# EAGLE board Calciatore Rev.2 DOWN (EAGLE 8.5.0)
Robot Calciatore SMD V2 Costruttori: Fabio Ricci Alessio Di Brigida
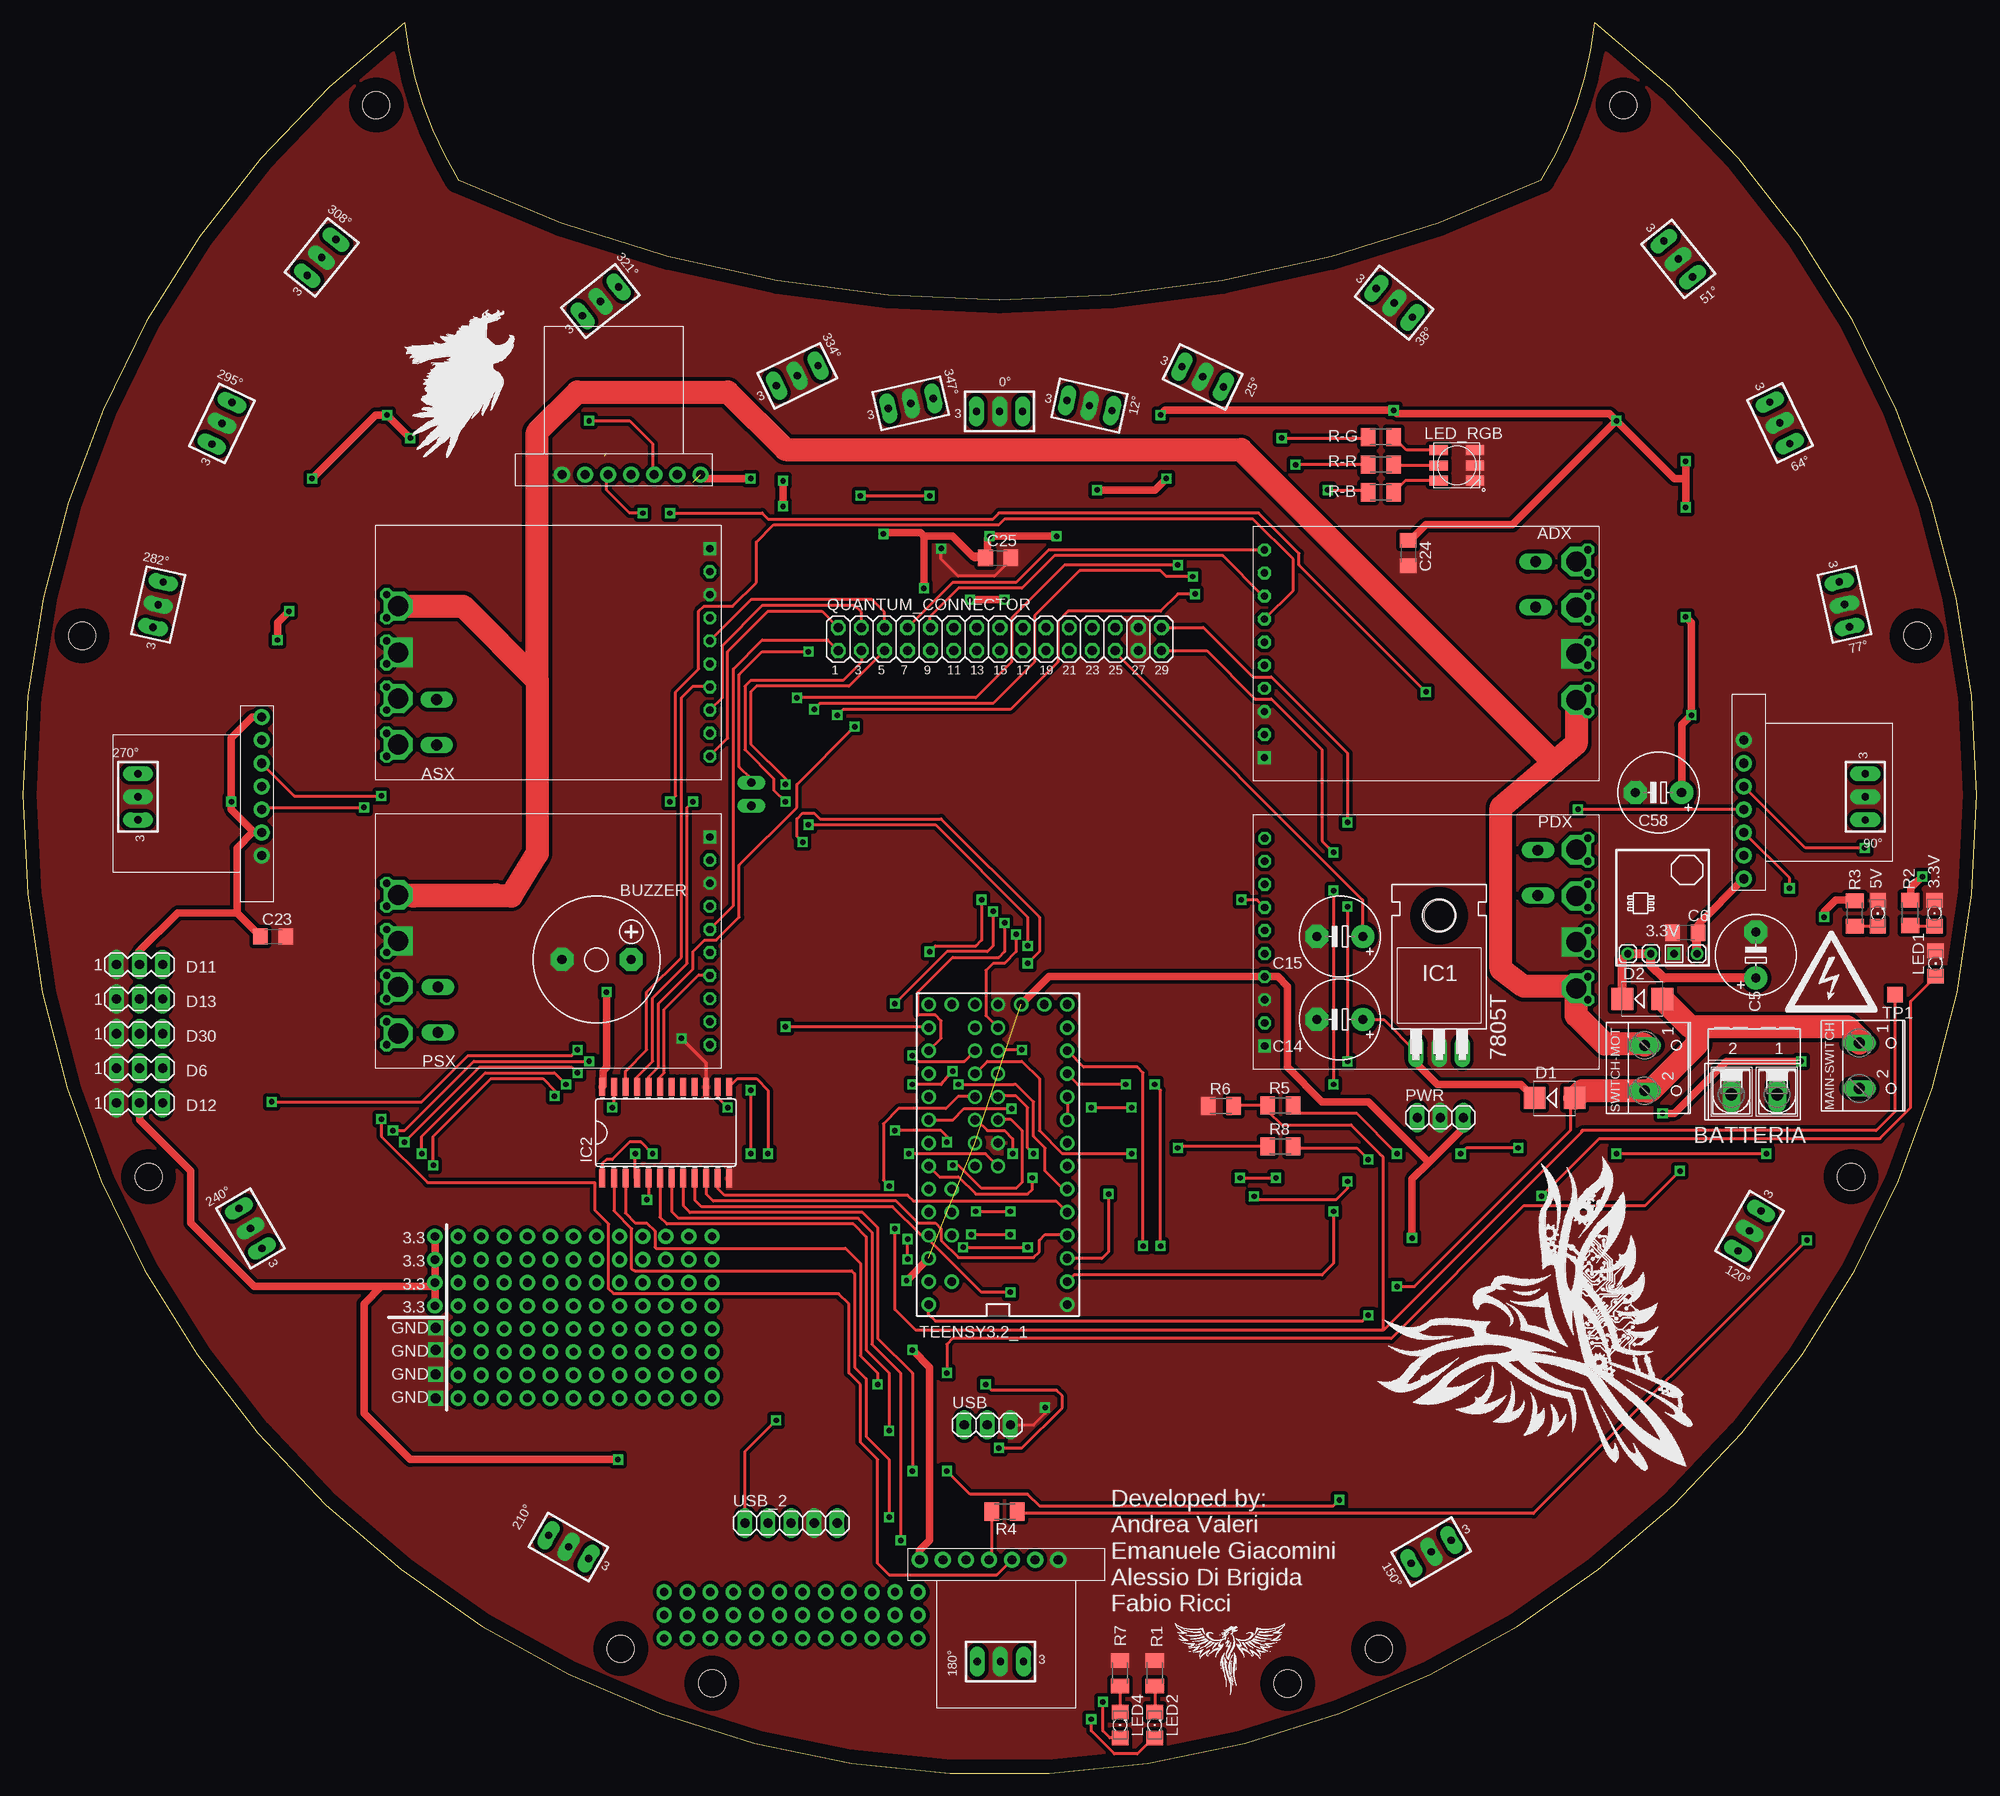
[diagram p3: board, top side]
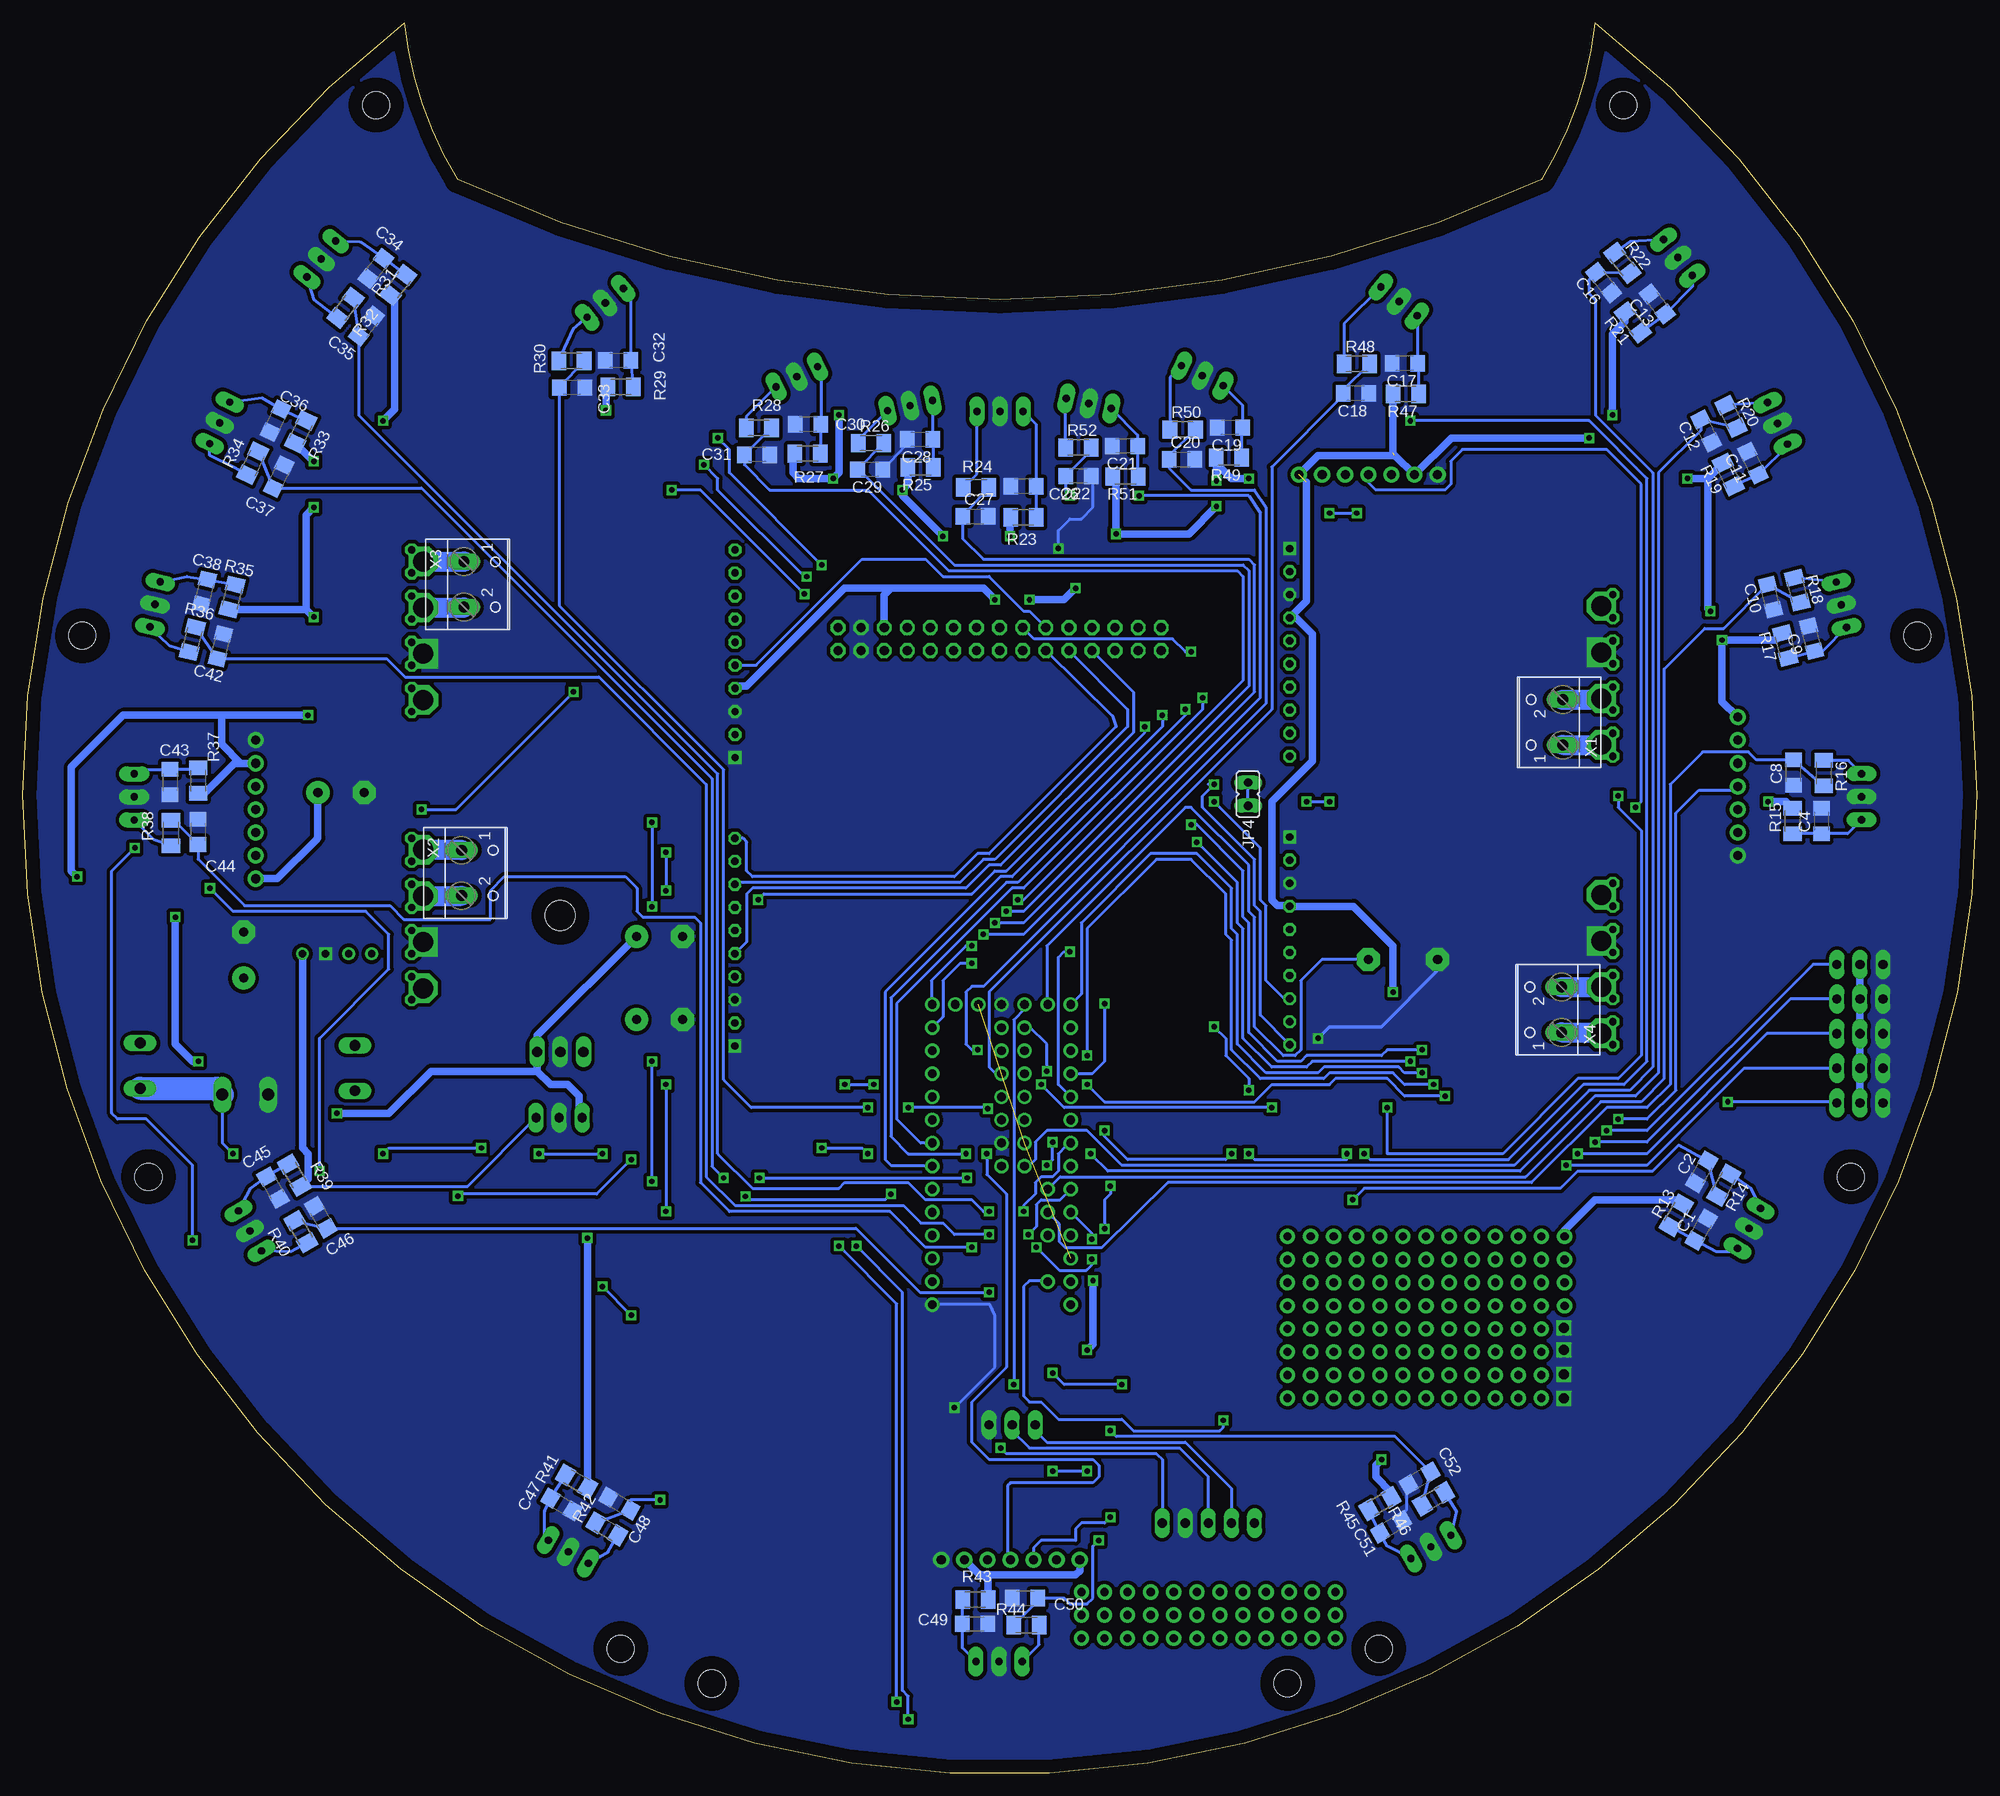
[diagram p4: board, bottom side, seen from below]

Size 214.99 x 192.6 mm. Coordinates in mm from the lower left corner, seen from the top.
Outline: 167.1,175.33 arc25 173,192.6 arc-25 167.1,175.33
Outline: 47.9,175.33 arc50 167.1,175.33
Outline: 47.9,175.33 arc-25 42,192.6 arc285 172.99,192.6
Copper layers (1*16): Top 0.035mm / dielectric 1.5mm / Bottom 0.035mm
Design rules "SparkFun *": minimum track width 8mil, minimum drill 20mil, track to track 8mil, track to pad 8mil, pad to pad 8mil, via to via 8mil, smd to smd 8mil, copper to edge 1.5mm, drill to drill 8mil, minimum pad ring 12mil, minimum via ring 10mil, stop-mask expansion 4mil, vias tented up to drill 25mil, thermal gap 0mil
Net classes: 0 default: width 0.254 mm, drill 0.254 mm, clearance 0.203 mm; 1 power: width 1.016 mm, drill 0.889 mm, clearance 0.508 mm; 2 gnd: width 0.864 mm, drill 0.406 mm, clearance 0.381 mm; 3 power usb: width 0.305 mm, drill 0.406 mm, clearance 0.203 mm
Holes 3 mm at 38.9,183.53 6.54,125.13 13.85,65.62 65.8,13.7 75.83,9.89 139.18,9.87 149.21,13.7 201.15,65.62 208.44,125.16 176.11,183.53

## Footprints (pad centres in the part's own frame; a part is rotated, then mirrored left to right if it is on the bottom)
TSOP4840 = drill 0.8 pad 1.676 long: GND 0,0; OUT -2.54,0; VCC 2.54,0
FKIT-LED-1206 = smd 1.6 x 1.803: A -1.422,0; C 1.422,0
MOTOR-SHIELD = drill 0.8 octagon: CS 29.21,-5.08; ENA/DIAGA 29.21,-10.16; ENB/DIAGB 29.21,-2.54; GND2 29.21,5.08; GNDMOT-2 -6.35,0; GNDMOT-3 -6.35,-2.54; INA 29.21,-12.7; INB 29.21,0; OUTA-2 -6.35,-10.16; OUTA-3 -6.35,-12.7; OUTB-2 -6.35,-5.08; OUTB-3 -6.35,-7.62; PWM 29.21,-7.62; VDD 29.21,2.54; VMOT-2 -6.35,5.08; VMOT-3 -6.35,2.54; VOUT 29.21,7.62 | drill 0.8 square: GND 29.21,10.16 | drill 2.2 square: GNDMOT-1 -5.08,-1.27 | drill 2.2 octagon: INMOT1 -5.08,-6.35; INMOT2 -5.08,-11.43; VMOT-1 -5.08,3.81
MB1010 = drill 1 pad 1.778: AN 2.54,-2.54; BW 7.62,-2.54; GND -7.62,-2.54; PW 5.08,-2.54; RX 0,-2.54; TX -2.54,-2.54; VCC -5.08,-2.54
AK500/2-H = drill 1.321 long: 1 -2.515,0; 2 2.515,0
F/CM12P = drill 1.016 pad 2.54 octagon: + 3.81,0; - -3.81,0
C1206 = smd 1.6 x 1.8: 1 -1.4,0; 2 1.4,0
E5-8,5 = drill 1.016 pad 2.54: + -2.54,0 | drill 1.016 pad 2.54 octagon: - 2.54,0
SMB = smd 2.4 x 2.4: A 2.2,0; C -2.2,0
MA03-1 = drill 1.016 long: 1 -2.54,0; 2 0,0; 3 2.54,0
TO220H = drill 1.118 long: 1 -2.54,-10.16; 2 0,-10.16; 3 2.54,-10.16 | hole 3.302: 0,4.826
SO24W = smd 0.66 x 2.032: 1 -6.985,-5.029; 2 -5.715,-5.029; 3 -4.445,-5.029; 4 -3.175,-5.029; 5 -1.905,-5.029; 6 -0.635,-5.029; 7 0.635,-5.029; 8 1.905,-5.029; 9 3.175,-5.029; 10 4.445,-5.029; 11 5.715,-5.029; 12 6.985,-5.029; 13 6.985,5.029; 14 5.715,5.029; 15 4.445,5.029; 16 3.175,5.029; 17 1.905,5.029; 18 0.635,5.029; 19 -0.635,5.029; 20 -1.905,5.029; 21 -3.175,5.029; 22 -4.445,5.029; 23 -5.715,5.029; 24 -6.985,5.029
JP1 = drill 0.914 long: 1 0,-1.27; 2 0,1.27
1206 = smd 1.6 x 1.803: A -1.422,0; C 1.422,0
RGBLED5050 = smd 2 x 1.1: 1 -2,1.7; 2 -2,0; 3 -2,-1.7; 4 2,-1.7; 5 2,0; 6 2,1.7
W237-102 = drill 1.194 long: 1 -2.5,-1.27; 2 2.5,-1.27
1X03 = drill 1.016 long: 1 -2.54,0; 2 0,0; 3 2.54,0
2X15 = drill 1.016 octagon: 1 -17.78,-1.27; 2 -17.78,1.27; 3 -15.24,-1.27; 4 -15.24,1.27; 5 -12.7,-1.27; 6 -12.7,1.27; 7 -10.16,-1.27; 8 -10.16,1.27; 9 -7.62,-1.27; 10 -7.62,1.27; 11 -5.08,-1.27; 12 -5.08,1.27; 13 -2.54,-1.27; 14 -2.54,1.27; 15 0,-1.27; 16 0,1.27; 17 2.54,-1.27; 18 2.54,1.27; 19 5.08,-1.27; 20 5.08,1.27; 21 7.62,-1.27; 22 7.62,1.27; 23 10.16,-1.27; 24 10.16,1.27; 25 12.7,-1.27; 26 12.7,1.27; 27 15.24,-1.27; 28 15.24,1.27; 29 17.78,-1.27; 30 17.78,1.27
M1206 = smd 1.6 x 2: 1 -1.4,0; 2 1.4,0
TEENSY3_ALL_PINS_&_PADS = drill 0.965: 0 -7.62,13.97; 1 -7.62,11.43; 2 -7.62,8.89; 3 -7.62,6.35; 3.3V 7.62,11.43; 3.3V1 -2.54,-16.51; 3.3V2 2.54,-1.27; 4 -7.62,3.81; 5 -7.62,1.27; 6 -7.62,-1.27; 7 -7.62,-3.81; 8 -7.62,-6.35; 9 -7.62,-8.89; 10 -7.62,-11.43; 11 -7.62,-13.97; 12 -7.62,-16.51; 13 7.62,-16.51; 14/A0 7.62,-13.97; 15/A1 7.62,-11.43; 16/A2 7.62,-8.89; 17/A3 7.62,-6.35; 18/A4 7.62,-3.81; 19/A5 7.62,-1.27; 20/A6 7.62,1.27; 21/A7 7.62,3.81; 22/A8 7.62,6.35; 23/A9 7.62,8.89; 24 0,-3.81; 25 0,-6.35; 26 0,-8.89; 27 0,-11.43; 28 0,-13.97; 29 2.54,-13.97; 30 2.54,-11.43; 31 2.54,-8.89; 32 2.54,-6.35; 33 2.54,-3.81; A10 5.08,6.35; A11 5.08,3.81; A12 0,1.27; A13 2.54,1.27; AGND 7.62,13.97; AREF 5.08,8.89; GND -7.62,16.51; GND1 0,-16.51; GND2 0,-1.27; PGM 2.54,-16.51; RESET/DAC 5.08,-16.51; VBAT -5.08,-16.51; VIN 7.62,16.51; VUSB 5.08,13.97
TP17SQ = smd 1.7 x 1.7: TP 0,0
QRE1113-W = smd 1.778 x 0.762: 1 -1.927,-0.9; 2 1.927,-0.9; 3 1.927,0.9; 4 -1.927,0.9
ALIM_SWITCHING = drill 0.8 square: GND 1.27,-3.81 | drill 0.8: SHDN -3.81,-3.81; VIN -1.27,-3.81; VOUT 3.81,-3.81
1X05 = drill 1.016 long: 1 -5.08,0; 2 -2.54,0; 3 0,0; 4 2.54,0; 5 5.08,0

## Placement (x,y rotation side)
0°  effe  [TSOP4840]  107.47,149.84 180 top
3.3V  Power LED  [FKIT-LED-1206]  210.34,94.61 90 top
5V  Power LED  [FKIT-LED-1206]  204.11,94.61 90 top
12°  effe  [TSOP4840]  117.38,150.48 167.2 top
25°  effe  [TSOP4840]  129.82,153.65 154.2 top
38°  effe  [TSOP4840]  150.91,161.78 141.4 top
51°  effe  [TSOP4840]  182.15,166.6 128.6 top
64°  effe  [TSOP4840]  193.32,148.57 115.8 top
77°  effe  [TSOP4840]  200.44,128.6 102.8 top
90°  effe  [TSOP4840]  202.72,107.42 90 top
120°  effe  [TSOP4840]  190,59.67 60 top
150°  effe  [TSOP4840]  154.97,24.36 30 top
180°  effe  [TSOP4840]  107.57,12.27 0 top
210°  effe  [TSOP4840]  60.05,24.9 330 top
240°  effe  [TSOP4840]  25.06,59.94 300 top
270°  effe  [TSOP4840]  12.67,107.44 270 top
282°  effe  [TSOP4840]  14.9,128.57 257.2 top
295°  effe  [TSOP4840]  21.91,148.53 244.2 top
308°  effe  [TSOP4840]  32.88,166.77 231.4 top
321°  effe  [TSOP4840]  63.57,161.94 218.6 top
334°  effe  [TSOP4840]  85.21,153.76 205.8 top
347°  effe  [TSOP4840]  97.71,150.72 192.8 top
ADX  VHN5019  [MOTOR-SHIELD]  165.84,121.9 180 top
ASX  VHN5019  [MOTOR-SHIELD]  46.38,124.59 0 top
AX  MB1010  [MB1010]  66.95,145.41 0 top
BATTERIA  [AK500/2-H]  190.52,74.67 180 top
BUZZER  F/CM12P  [F/CM12P]  63.14,89.53 0 top
C1  [C1206]  30.32,59.81 60 bottom
C2  [C1206]  30.27,66.16 60 bottom
C4  [C1206]  17.06,104.77 90 bottom
C5  [E5-8,5]  190.69,90.02 90 top
C6  100n  [C1206]  182.94,92.46 180 top
C8  [C1206]  20.16,110.1 90 bottom
C9  [C1206]  18.18,124.83 104 bottom
C10  [C1206]  22.7,129.41 104 bottom
C11  [C1206]  24.63,144.14 116 bottom
C12  [C1206]  29.76,147.69 116 bottom
C13  [C1206]  35.15,161.66 128 bottom
C14  [E5-8,5]  144.92,82.92 180 top
C15  220uF  [E5-8,5]  144.92,92.07 180 top
C16  [C1206]  41.04,164 128 bottom
C17  [C1206]  62.93,155.11 180 bottom
C18  [C1206]  68.32,151.81 180 bottom
C19  470n  [C1206]  82.19,148.05 180 bottom
C20  470n  [C1206]  87.47,144.54 0 bottom
C21  [C1206]  93.72,146.02 180 bottom
C22  [C1206]  98.85,142.72 180 bottom
C23  100n  [C1206]  27.58,92.07 0 top
C24  100n  [C1206]  152.42,134.23 270 top
C25  100n  [C1206]  107.33,133.72 0 top
C26  470n  [C1206]  104.91,141.58 180 bottom
C27  470n  [C1206]  110.18,138.28 0 bottom
C28  [C1206]  116.28,146.74 180 bottom
C29  [C1206]  121.75,143.42 180 bottom
C30  [C1206]  128.57,148.42 180 bottom
C31  [C1206]  134.19,145.07 180 bottom
C32  [C1206]  149.48,155.43 180 bottom
C33  [C1206]  154.56,152.44 180 bottom
C34  [C1206]  176.13,165.58 232 bottom
C35  [C1206]  177.16,159.25 232 bottom
C36  [C1206]  187.16,148.82 244 bottom
C37  [C1206]  186.83,142.66 244 bottom
C38  [C1206]  195.02,129.99 256 bottom
C42  [C1206]  193.25,123.99 256 bottom
C43  [C1206]  198.8,109.04 270 bottom
C44  [C1206]  195.71,103.58 270 bottom
C45  [C1206]  187.46,64.43 300 bottom
C46  [C1206]  182.2,61.16 300 bottom
C47  [C1206]  155.71,29.57 330 bottom
C48  [C1206]  149.34,29.67 330 bottom
C49  [C1206]  110.22,16.43 0 bottom
C50  [C1206]  104.72,19.28 0 bottom
C51  [C1206]  64.44,27.12 30 bottom
C52  [C1206]  61.31,32.44 30 bottom
C58  220uF  [E5-8,5]  179.98,107.89 180 top
D1  M7  [SMB]  168.55,74.29 0 top
D2  M7  [SMB]  178.21,85.2 0 top
D6  [MA03-1]  12.86,77.56 0 top
D11  [MA03-1]  12.85,88.98 0 top
D12  [MA03-1]  12.86,73.75 0 top
D13  [MA03-1]  12.86,85.18 0 top
D30  [MA03-1]  12.86,81.37 0 top
DX  MB1010  [MB1010]  191.91,106.04 270 top
HIGHVOLTAGE  LOGO  [LOGOHV]  198.52,87.24 0 top
IC1  7805T  [TO220H]  155.85,89.53 0 top
IC2  4067D  [SO24W]  70.76,70.48 0 top
JP4  [JP1]  80.17,107.72 180 bottom
LED1  [1206]  210.47,89.09 90 top
LED2  [1206]  124.55,5.3 90 top
LED4  [1206]  120.74,5.3 90 top
LED_RGB  RGBLED5050  [RGBLED5050]  157.79,143.9 0 top
MAIN-SWITCH  [W237-102]  203.34,77.84 270 top
PDX  VHN5019  [MOTOR-SHIELD]  165.85,90.18 180 top
PSX  VHN5019  [MOTOR-SHIELD]  46.4,92.84 0 top
PWR  [1X03]  155.97,72.13 0 top
PX  MB1010  [MB1010]  106.32,20.95 180 top
QUANTUM_CONNECTOR  [2X15]  107.51,124.78 0 top
R1  330  [M1206]  124.55,11.01 270 top
R2  1K  [M1206]  207.66,94.67 90 top
R3  1K  [M1206]  201.57,94.61 90 top
R4  [M1206]  108.04,28.79 180 top
R5  10k  [M1206]  138.37,73.48 0 top
R6  3.3k  [M1206]  131.84,73.4 0 top
R7  330  [M1206]  120.74,11.01 270 top
R8  330  [M1206]  138.38,68.96 0 top
R13  [M1206]  33.06,61.39 60 bottom
R14  [M1206]  27.84,64.7 240 bottom
R15  [M1206]  20.26,104.77 90 bottom
R16  [M1206]  16.82,110.04 270 bottom
R17  [M1206]  21.07,124.07 104 bottom
R18  [M1206]  19.75,130.17 284 bottom
R19  [M1206]  27.32,142.87 116 bottom
R20  [M1206]  27.03,149.28 296 bottom
R21  [M1206]  37.84,159.63 128 bottom
R22  [M1206]  38.99,166.18 308 bottom
R23  1K  [M1206]  104.91,138.18 180 bottom
R24  33K  [M1206]  110.09,141.48 0 bottom
R25  [M1206]  116.22,143.67 180 bottom
R26  [M1206]  121.67,146.34 0 bottom
R27  [M1206]  128.63,145.2 180 bottom
R28  [M1206]  134,148.03 0 bottom
R29  [M1206]  149.19,152.54 180 bottom
R30  [M1206]  154.63,155.39 0 bottom
R31  [M1206]  173.68,163.74 232 bottom
R32  [M1206]  179.48,161.21 52 bottom
R33  [M1206]  184.4,147.59 244 bottom
R34  [M1206]  189.68,144.13 64 bottom
R35  [M1206]  191.96,129.41 256 bottom
R36  [M1206]  196.33,124.72 76 bottom
R37  [M1206]  195.67,109.2 270 bottom
R38  [M1206]  198.68,103.45 90 bottom
R39  [M1206]  185.09,65.8 300 bottom
R40  [M1206]  184.38,59.58 120 bottom
R41  [M1206]  154.06,32.11 330 bottom
R42  [M1206]  150.74,26.87 150 bottom
R43  [M1206]  110.18,19.11 0 bottom
R44  [M1206]  104.57,16.3 180 bottom
R45  [M1206]  65.66,29.66 30 bottom
R46  [M1206]  59.78,30.19 210 bottom
R47  [M1206]  62.83,151.76 180 bottom
R48  [M1206]  68.22,155.06 0 bottom
R49  1K  [M1206]  82.29,144.75 180 bottom
R50  33K  [M1206]  87.37,147.85 0 bottom
R51  [M1206]  93.67,142.67 180 bottom
R52  [M1206]  98.85,145.87 0 bottom
R-B  100  [M1206]  149.43,140.93 0 top
R-G  100  [M1206]  149.43,147.02 0 top
R-R  180  [M1206]  149.43,143.97 0 top
SWITCH-MOT  [W237-102]  179.72,77.59 270 top
SX  MB1010  [MB1010]  23.77,108.58 90 top
TEENSY3.2_1  TEENSY_3.1_ALL_PINS_AND_PADS  [TEENSY3_ALL_PINS_&_PADS]  107.31,68.07 180 top
TP1  PTR1TP17SQ  [TP17SQ]  205.99,85.65 90 top
U1  QRE1113SMD-W  [QRE1113-W]  -22.49,-23.38 0 top  (outside the outline)
U$5  [EAGLE-PLC-12MM]  54.05,161.02 180 top
U$8  PHOENIX_LOGHI  [PHOENIX_LOGHI]  126.48,8.4 0 top
U$10  ALIM  [ALIM_SWITCHING]  180.41,93.97 0 top
U$12  [PHOENIX]  168.93,48.38 45 top
USB  [1X03]  106.13,38.32 0 top
USB_2  [1X05]  84.54,27.52 0 top
X1  [W237-102]  46.82,115.63 90 bottom
X2  [W237-102]  165.45,99.06 270 bottom
X3  [W237-102]  165.18,130.8 270 bottom
X4  [W237-102]  46.96,84.01 90 bottom

## Tracks (layer width: path | path; a pad name or v marks a point on that pad's centre or on a via)
3.3V  (via drill 0.6, 0.9 pad 1.68)  (4 unrouted)
  Top 0.305: 25.76,91.66 C23.1 | 207.73,96.14 R2.2 | C24.1 152.65,135.63 | 94.83,136.49 v94.7,136.36
  Top 0.813: C6.1 184.33,93.38 DX.BW | 207.73,96.14 207.73,97.37 v209,98.64 | v182.97,127.22 183.6,126.58 v183.6,116.42 182.53,115.35 182.53,107.91 C58.+ | v182.97,139.28 182.97,142.46 | 182.97,142.46 v182.97,144.36 | 182.97,142.46 181.7,142.46 v175.35,148.81 | v175.35,148.81 174.58,149.57 151.22,149.57 v150.84,149.95 125.69,149.95 v125.18,149.44 | 152.65,135.63 154.39,137.38 163.92,137.38 v175.35,148.81 | v125.82,142.46 124.55,141.19 v118.2,141.19 | v113.75,136.11 v106.39,136.11 106.13,135.85 106.13,133.92 | 106.13,133.92 104.5,133.92 | 104.5,133.92 102.32,136.11 99.15,136.11 | 94.83,136.49 98.77,136.49 99.15,136.11 | 104.5,133.92 104.7,133.72 C25.1 106.13,133.92 | 99.15,136.11 v99.15,130.39 | v104.23,129.12 v108.04,129.12 | v83.65,139.41 v83.65,142.2 | v80.1,142.46 74.98,142.46 AX.BW | v42.63,146.9 v40.09,149.44 38.82,149.44 v31.84,142.46 | v29.3,127.85 28.03,126.58 v28.03,124.68 | SX.BW 25.26,116.2 22.95,113.88 v22.95,106.9 22.95,106.04 25.49,103.5 | SX.VCC 25.49,103.5 | 25.49,103.5 25.26,103.5 23.58,101.82 23.58,94.66 | 23.58,94.66 C23.1 | 23.58,94.66 17.06,94.66 12.79,90.39 12.79,89.04 D11.2 | D12.2 12.86,71.9 18.5,66.26 18.5,60.54 25.49,53.56 39.46,53.56 | 39.46,53.56 44.94,53.56 v45.36,53.97 | v45.36,51.43 v45.36,53.97 | v45.36,53.97 v45.36,56.51 v45.36,59.05 | v65.49,34.51 42.63,34.51 37.55,39.59 37.55,51.65 39.46,53.56 | 154.71,67.21 148.04,73.88 142.96,73.88 139.15,77.69 139.15,86.58 138.09,87.64 PDX.VDD 112.91,87.64 TEENSY3.2_1.3.3V1 | PWR.3 158.51,71.01 154.71,67.21 | 154.71,67.21 152.87,65.37 v152.87,58.89 | PX.BW 98.7,24.53 99.78,25.62 99.78,44.67 v97.88,46.57 | v97.24,54.19 TEENSY3.2_1.3.3V
  Top 0.813: v64.22,85.94 64.22,77.64 63.87,77.28 63.87,75.6 IC2.24
  Top 1: U$10.VOUT 184.22,92.34 C6.1
  Bottom 0.305: R39.2 166.06,64.59 PWR.3 | ASX.VDD 75.1,127.13 | 196.44,107.8 R37.2 195.03,107.8 | 152.84,58.61 v152.87,58.89 | 28.03,143.73 28.03,144.04 R19.2 | 184.24,146.27 184.95,146.27 R33.2 | 83.27,144.33 R49.2 | 106.18,137.42 R23.2 106.13,138.01 | 117.56,143.38 R25.2
  Bottom 0.813: U$10.VOUT 184.22,68.78 183.6,68.16 183.6,65.38 R39.2 | DX.BW 187,98.42 182.66,102.76 182.66,102.78 182.53,102.91 182.53,107.87 C58.+ | 195.03,107.8 191.71,111.12 DX.VCC 191,111.12 193.13,113.25 193.13,116.42 | v209,98.64 209.64,99.28 209.64,110.71 203.92,116.42 193.13,116.42 | v183.6,116.42 193.13,116.42 | R35.2 183.8,128.05 | 183.8,128.05 v182.97,127.22 | 183.8,128.05 183.8,138.45 v182.97,139.28 | v182.97,144.36 183.05,144.36 R33.2 | v175.35,148.81 174.08,150.08 174.08,162.17 R31.2 | v150.84,149.95 150.84,152.29 R29.2 | v125.18,149.44 125.18,143.09 v125.82,142.46 129.63,142.46 130.26,143.09 130.26,144.97 R27.2 | R25.2 117.56,143.61 117.56,141.82 v118.2,141.19 118.2,140.55 v113.75,136.11 | v106.39,136.11 106.39,137.22 106.18,137.42 | R51.2 94.7,142.3 v94.7,136.36 86.7,136.36 v83.65,139.41 | v99.15,130.39 100.42,129.12 v104.23,129.12 | v108.04,129.12 109.31,130.39 119.47,130.39 | 119.47,130.39 124.55,130.39 135.34,119.6 136.39,119.6 ADX.VDD | QUANTUM_CONNECTOR.26 120.21,129.65 119.47,130.39 | v83.65,142.2 83.65,143.73 | 83.65,143.73 83.65,143.95 83.27,144.33 | v80.1,142.46 82,142.46 83.27,143.73 83.65,143.73 | AX.BW 74.57,142.91 72.48,145 63.99,145 AX.VCC 57.83,146.9 v42.63,146.9 | 64.23,145.23 R47.2 | R21.2 38.7,159.72 40.09,158.33 v40.09,149.44 | v31.84,142.46 29.61,142.46 | 29.61,142.46 R19.2 | 29.61,142.46 29.61,128.16 v29.3,127.85 | R17.2 22.17,124.68 v28.03,124.68 28.03,117.92 SX.BW | v22.95,106.9 20.99,106.9 R15.2 | D11.2 D13.2 D30.2 D6.2 D12.2 | v45.36,59.05 45.36,59.72 42,63.08 32.85,63.08 R13.2 | R45.2 64.45,30.92 66.13,32.6 66.13,33.87 v65.49,34.51 | 152.84,58.61 R41.2
  Bottom 0.813: v97.88,46.57 97.24,47.21 v97.24,54.19 | PX.BW 98.7,22.26 99.15,21.81 109.31,21.81 | 109.31,21.81 109.71,21.81 PX.VCC | R43.2 108.78,21.28 109.31,21.81 | 73.75,142.05 73.75,128.98 ASX.VDD | 75.1,127.13 74.93,127.13 73.11,125.31 73.11,111.34 77.56,106.9 77.56,96.1 76.92,95.47 75.69,95.47 PSX.VDD 68.58,95.38 64.22,91.02 v64.22,85.94
5V  (via drill 0.6)
  Top 0.305: QUANTUM_CONNECTOR.25 120.21,123.3 147.41,96.1 147.41,92.13 C15.+
  Top 0.813: v180.43,72.61 181.7,72.61 187.41,78.32 v195.67,78.32 | v198.21,94.2 198.21,94.83 199.48,96.1 201.47,96.1 R3.2
  Bottom 0.813: 158.39,77.24 IC1.3 158.39,81.15 C15.+ | 158.39,77.24 156.93,75.78 155.03,75.78 153.76,74.51 153.76,72.46 PWR.1 | 158.39,77.24 170.08,77.24 174.71,72.61 v180.43,72.61 | v195.67,78.32 196.3,78.32 198.21,80.23 v198.21,94.2
BATLVL  (via drill 0.6)
  Top 0.305: TP1.TP 205.99,72.77 203.92,70.7 171.54,70.7 171.54,70.57 149.69,48.73 | 149.69,48.73 98.26,48.73 95.97,51.02 v95.97,59.91 | TEENSY3.2_1.32 104.67,74.51 102.96,74.51 101.56,73.11 96.35,73.11 94.7,71.46 94.7,65.24 v95.34,64.61 | R6.2 133.32,73.48 R5.1 136.97,72.89 138.52,71.34 146.14,71.34 149.31,68.16 149.69,67.78 149.69,48.73
  Bottom 0.305: v95.34,64.61 95.34,63.72 95.97,63.08 v95.97,59.91
BLUE(RGB)  (via drill 0.6)
  Top 0.305: v128.99,129.76 127.09,129.76 125.18,127.85 115.02,127.85 113.88,126.71 113.88,122.26 108.67,117.06 90.26,117.06 v89.62,116.42 | v143.6,141.19 147.77,141.19 R-B.1
  Bottom 0.305: v128.99,129.76 140.42,141.19 v143.6,141.19 | v89.62,116.42 89.62,115.15 106.13,98.64 107.4,98.64 120.1,85.94 120.1,67.53 119.47,66.89 115.02,66.89 TEENSY3.2_1.5
BUZZER
  Bottom 0.305: TEENSY3.2_1.RESET/DAC 102.32,84.67 102.32,91.02 87.08,106.26 86.45,106.26 80.1,99.91 80.1,94.83 79.46,94.2 79.46,82.13 76.29,78.96 75.02,78.96 74.38,79.59 74.38,87.21 72.07,89.53 BUZZER.+
CS1
  Top 0.305: IC2.22 66.31,77.24 68.67,79.59 68.67,85.94 72.48,89.75 72.48,118.33 73.75,119.6 75.51,119.6 ASX.CS
CS2  (via drill 0.6)
  Top 0.305: IC2.21 67.58,76.6 69.3,78.32 69.3,85.31 73.11,89.12 73.11,106.26 v73.75,106.9 | v71.21,106.9 71.84,107.53 71.84,118.96 74.38,121.5 74.38,127.85 74.94,128.41 78.12,128.41 80.73,131.03 80.73,135.47 82.64,137.38 107.4,137.38 108.04,138.01 135.34,138.01 139.79,133.57 139.79,130.14 ADX.CS
  Bottom 0.305: v73.75,106.9 v71.21,106.9
CS3  (via drill 0.6)
  Top 0.305: IC2.20 68.85,76.6 69.94,77.69 69.94,84.67 73.75,88.48 73.75,90.39 75.02,91.66 76.29,91.66 78.83,94.2 78.83,99.91 85.18,106.26 85.18,108.8 v91.53,115.15 | PDX.CS 135.8,96.1 v134.07,96.1
  Bottom 0.305: v134.07,96.1 133.44,96.74 110.58,96.74 108.04,99.28 106.77,99.28 91.53,114.52 v91.53,115.15
CS4
  Top 0.305: IC2.19 70.12,76.6 70.57,77.05 70.57,84.04 74.38,87.85 75.52,87.85 PSX.CS
D+
  Bottom 0.305: USB_2.3 84.54,32.6 87.72,35.78 104.23,35.78 106.13,37.68 USB.2
D-
  Bottom 0.305: USB.1 103.59,37.68 102.32,36.41 87.08,36.41 82,31.33 USB_2.2
EXP-READ-1  (via drill 0.6)
  Top 0.305: TEENSY3.2_1.14/A0 99.59,82.13 v83.91,82.13 | v80.1,75.15 v80.1,68.16 | v69.3,68.16 68.03,69.43 66.76,69.43 64.86,67.53 64.22,67.53 63.77,67.08 IC2.1
  Bottom 0.305: v83.91,82.13 82.64,80.86 82.64,78.96 80.1,76.42 v80.1,75.15 | v80.1,68.16 79.46,67.53 69.3,67.53 v69.3,68.16
EXPA
  Top 0.305: IC2.10 75.2,63.72 75.96,62.95 96.1,62.95 98.51,60.54 100.42,60.54 101.05,59.91 101.05,58.64 102.96,56.73 111.21,56.73 111.85,57.37 111.85,58.64 112.48,59.27 114.83,59.27 TEENSY3.2_1.2
EXPB
  Top 0.305: IC2.11 76.47,64.35 77.23,63.59 97.37,63.59 98,62.95 113.69,62.95 TEENSY3.2_1.3
EXPC  (via drill 0.6)
  Top 0.305: IC2.14 76.47,74.33 v77.56,73.24 | v102.96,75.78 108.67,75.78 109.05,75.78 109.31,75.78 111.21,73.88 111.21,70.07 112.48,68.8 112.48,66.26 114.48,64.25 TEENSY3.2_1.4
  Bottom 0.305: v77.56,73.24 100.42,73.24 v102.96,75.78
EXPD  (via drill 0.6)
  Top 0.305: TEENSY3.2_1.24 107.4,71.97 108.67,71.97 109.94,70.7 109.94,64.99 109.31,64.35 105.5,64.35 102.96,66.89 v102.32,66.89 | IC2.13 78.65,76.42 80.73,76.42 82,75.15 v82,68.16 | v101.69,69.43 101.69,70.07 101.05,70.7 v95.97,70.7
  Bottom 0.305: v102.32,66.89 101.69,67.53 v101.69,69.43 | v82,68.16 82.64,67.53 93.43,67.53 95.97,70.07 v95.97,70.7
GND  (via drill 0.6, 1.1)
  Top 0.305: v112.48,40.22 112.48,39.59 111.21,38.32 USB.3 | C25.2 108.73,132.99 108.17,132.99 106.89,131.71 102.91,131.71 101.05,133.57 v101.05,134.76
  Top 0.406: v72.48,80.86 75.19,78.14 IC2.15
  Bottom 0.305: C51.2 63.22,28.49 62.72,28.99 62.72,31.53 C52.1 | TEENSY3.2_1.GND 108.57,51.55 108.04,50.38 108.04,44.67 v112.48,40.22 | v101.05,134.76 101.05,136.74 99.78,138.01 98.51,138.01 97.24,139.28 97.24,142.51 C22.1 | C29.1 117.87,146.06 C28.2
  Bottom 0.406: BUZZER.- 59.33,88.3 65.49,82.13 71.21,82.13 v72.48,80.86
  other vias: 45.43,48.98 45.43,46.57 45.43,43.9 45.43,41.24
  pour Top (isolate 0.406): -25.31,195.8 245.83,192.62 245.83,-21.37 -25.31,-18.2
  pour Bottom (isolate 0.406): -19.6,197.07 258.53,195.8 258.53,-19.47 -19.6,-18.2
GREEN(RGB)  (via drill 0.6)
  Top 0.305: v127.09,132.93 114.64,132.93 108.8,127.09 108.8,122.26 104.86,118.33 v85.18,118.33 | v138.52,146.9 147.91,146.9 R-G.1
  Bottom 0.305: v127.09,132.93 137.25,143.09 137.25,145.63 v138.52,146.9 | v85.18,118.33 85.18,117.06 104.86,97.37 106.13,97.37 118.83,84.67 118.83,71.97 116.19,69.33 TEENSY3.2_1.6
INA1-31-2
  Top 0.305: ASX.INA 75.59,111.92 77.56,113.88 77.56,123.41 82,127.85 87.93,127.85 QUANTUM_CONNECTOR.2
INA2-32-2
  Top 0.305: ADX.INA 112.88,134.6 109.31,131.03 102.32,131.03 QUANTUM_CONNECTOR.8
INA3-33-2
  Bottom 0.305: 136.43,103.09 PDX.INA 135.77,102.88 135.34,102.45 135.34,99.28 134.71,98.64 112.48,98.64 109.94,101.18 108.67,101.18 94.7,115.15 95.08,116.32 QUANTUM_CONNECTOR.11
INA4-34-2  (via drill 0.6)
  Top 0.305: QUANTUM_CONNECTOR.5 | QUANTUM_CONNECTOR.5 90.89,119.6 80.73,119.6 80.1,118.96 80.1,113.25 83.91,109.44 v83.91,108.8
  Bottom 0.305: 84.54,108.8 v83.91,108.8 85.18,107.53 85.18,106.26 79.46,100.55 79.46,95.47 78.83,94.83 78.83,83.4 75.61,80.18 PSX.INA
INB1-35-2
  Top 0.305: QUANTUM_CONNECTOR.6 94.81,127.74 93.43,129.12 80.12,129.12 ASX.INB
INB2-36-2
  Bottom 0.305: ADX.INB 134.31,121.9 122.64,133.57 115.66,133.57 113.75,131.66 108.67,131.66 104.86,127.85 104.23,127.85 QUANTUM_CONNECTOR.12
INB3-37-2
  Bottom 0.305: 136.43,90.39 PDX.INB 135.34,91.48 135.34,96.74 134.71,97.37 111.21,97.37 108.67,99.91 107.4,99.91 92.8,114.52 92.8,118.96 QUANTUM_CONNECTOR.7
INB4-38-2
  Top 0.305: PSX.INB 75.61,92.88 78.19,95.47 78.19,121.5 81.37,124.68 88.57,124.68 QUANTUM_CONNECTOR.1
LED1  (via drill 0.6)
  Top 0.305: LED4.A 119.62,3.87 118.83,4.66 v118.83,7.84 | 115.02,77.05 TEENSY3.2_1.9 116.1,75.78 v121.37,75.78 | v125.18,58 125.18,75.15 v124.55,75.78
  Bottom 0.305: v118.83,7.84 118.83,51.65 v125.18,58 | v124.55,75.78 v121.37,75.78
LED2  (via drill 0.6)
  Top 0.305: LED2.A 124.39,3.87 122.64,2.12 120.1,2.12 117.56,4.66 v117.56,5.93 | TEENSY3.2_1.10 116.73,77.69 122.64,77.69 123.28,77.05 v123.28,58
  Bottom 0.305: v117.56,5.93 117.56,8.47 118.2,9.11 118.2,52.92 v123.28,58
LED_ALIM  (via drill 0.6)
  Top 0.305: TEENSY3.2_1.31 106.13,78.32 109.94,78.32 111.85,76.42 111.85,70.7 114.39,68.16 v122.01,68.16 | R8.1 127.25,68.96 v127.09,68.8
  Bottom 0.305: v127.09,68.8 122.64,68.8 v122.01,68.16
MISO_12  (via drill 0.6)
  Top 0.305: v27.39,73.88 43.9,73.88 48.98,78.96 60.41,78.96 v61.05,79.59 | v86.45,104.36 100.42,104.36 110.58,94.2 v110.58,91.02
  Bottom 0.305: D12.3 15.52,73.88 v27.39,73.88 | v61.05,79.59 64.86,79.59 65.49,78.96 73.75,78.96 74.38,78.32 76.92,78.32 80.1,81.5 80.1,93.56 80.73,94.2 80.73,99.28 85.81,104.36 v86.45,104.36 | v110.58,91.02 111.21,91.02 115.02,87.21 115.02,84.67 TEENSY3.2_1.12
MOSI_11  (via drill 0.6)
  Top 0.305: v40.73,70.7 42,70.7 49.62,78.32 v62.32,78.32 | v85.81,102.45 85.18,103.09 85.18,104.99 85.81,105.63 87.08,105.63 87.72,104.99 101.05,104.99 111.85,94.2 111.85,90.39 v110.58,89.12
  Bottom 0.305: D11.3 18,88.98 36.28,70.7 v40.73,70.7 | v62.32,78.32 73.11,78.32 73.75,77.69 77.56,77.69 80.73,80.86 80.73,92.93 81.37,93.56 81.37,98.01 v85.81,102.45 | v110.58,89.12 111.85,89.12 113.75,87.21 113.75,83.21 TEENSY3.2_1.11
MOTORE1-1
  Bottom 2.184: X1.1 41.34,113.13 ASX.INMOT2
MOTORE1-2
  Bottom 2.184: X1.2 41.42,118.13 ASX.INMOT1
MOTORE2-1
  Bottom 2.184: PDX.INMOT2 166.77,101.61 X2.1
MOTORE2-2
  Bottom 2.184: PDX.INMOT1 166.75,96.53 X2.2
MOTORE3-1
  Bottom 2.184: ADX.INMOT2 166.48,133.33 X3.1
MOTORE3-2
  Bottom 2.184: ADX.INMOT1 166.5,128.25 X3.2
MOTORE4-1
  Bottom 2.184: X4.1 41.41,81.51 PSX.INMOT2
MOTORE4-2
  Bottom 2.184: X4.2 41.33,86.51 PSX.INMOT1
N$1
  Top 0.305: R1.2 LED2.C
N$2  (via drill 0.6)
  Top 0.305: R8.2 139.95,68.8 146.77,68.8 v148.04,67.53 | v167.12,63.51 173.44,69.84 204.33,69.84 207.73,73.24 207.73,84.93 LED1.A
  Bottom 0.305: v148.04,67.53 151.85,63.72 166.91,63.72 v167.12,63.51
N$3
  Bottom 0.305: 0°.VCC 103.51,148.41 C26.1 R23.1
N$4
  Bottom 0.305: R24.1 110.01,142.96 0°.OUT
N$6
  Bottom 0.305: 12°.VCC 114.91,151.03 C28.1 114.82,146.52 R25.1
N$7
  Bottom 0.305: 12°.OUT 123,146.77 R26.1
N$9
  Bottom 0.305: R13.1 C1.1 28.66,57.37 26.7,57.37 240°.VCC
N$13
  Bottom 0.305: 270°.VCC 14.19,103.37 C4.1 R15.1
N$14
  Bottom 0.305: 282°.VCC 16.95,123.48 C9.1 R17.1
N$15
  Bottom 0.305: 25°.OUT 135.4,149.25 R28.1
N$16
  Bottom 0.305: R30.1 154.39,158.97 38°.OUT
N$17
  Top 1: C5.+ 180.54,87.48 179.16,88.86 179.16,90.14 U$10.VIN U$10.SHDN 176.01,89.58 D2.C
N$18
  Bottom 0.305: 51°.OUT 182.97,162.14 R32.1
N$20
  Bottom 0.305: 25°.VCC 127.17,154.39 C30.1 127.23,148.36 R27.1
N$24
  Bottom 0.305: 295°.VCC 20.81,146.09 C11.1 R19.1
N$25
  Bottom 0.305: 308°.VCC 31.3,163.54 C13.1 R21.1
N$26
  Bottom 0.305: 321°.VCC 61.53,160.31 C17.1 61.43,155.01 R47.1
N$27
  Bottom 0.305: R34.1 191.86,143.73 194.4,145 64°.OUT
N$28
  Bottom 0.305: R29.1 C32.1 148.08,162.52 38°.VCC
N$34
  Bottom 0.305: R36.1 198.84,124.04 77°.OUT
N$35
  Bottom 0.305: 51°.VCC 177.89,168.49 C34.1 R31.1
N$36
  Bottom 0.305: R40.1 185.51,57.37 120°.OUT
N$37
  Bottom 0.305: 64°.VCC 188.68,151.35 C36.1 R33.1
N$38
  Bottom 0.305: 180°.OUT 103.17,14.14 R44.1
N$39
  Bottom 0.305: 77°.VCC 196.94,131.66 C38.1 R35.1
N$40
  Bottom 0.305: R38.1 200.53,102.69 90°.OUT
N$41
  Bottom 0.305: 90°.VCC 202.25,110.44 C43.1 195.84,110.44 R37.1
N$42
  Bottom 0.305: 150°.OUT 150.58,24.35 R42.1
N$43
  Bottom 0.305: 120°.VCC 189.95,64.35 C45.1 R39.1
N$44
  Bottom 0.305: R46.1 57.24,28.79 210°.OUT
N$45
  Bottom 0.305: 150°.VCC 157.57,26.03 157.57,28.79 C47.1 R41.1
N$51
  Bottom 0.305: R14.1 24.85,64.35 240°.OUT
N$52
  Bottom 0.305: 180°.VCC 111.62,13.78 C49.1 111.58,16.47 R43.1
N$53
  Bottom 0.305: 270°.OUT 14.13,111.44 R16.1
N$54
  Bottom 0.305: 210°.VCC 64.86,24.98 C51.1 R45.1
N$56
  Bottom 0.305: 282°.OUT R18.1
N$57
  Bottom 0.305: 295°.OUT R20.1
N$60
  Bottom 0.305: 308°.OUT 38.19,168.49 R22.1
N$64
  Top 0.305: 3.3V.A 207.74,93.19 R2.1
N$65
  Bottom 0.305: 321°.OUT 69.62,159.46 R48.1
N$67
  Top 0.305: LED_RGB.3 152.1,142.2 R-B.2
N$68
  Top 0.305: LED_RGB.1 152.26,145.6 R-G.2
N$69
  Top 0.305: R7.2 LED4.C
N$81
  Top 0.305: LED_RGB.2 150.91,143.9 R-R.2
N$95
  Top 0.305: C14.+ 149.75,82.92 IC1.1 153.25,79.31 153.25,78.19
  Top 0.813: 153.25,78.19 155.66,75.78 164.85,75.78 D1.C
N$97
  Top 0.305: 5V.A 201.59,93.19 R3.1
N$135  (via drill 0.9 pad 1.68)
  other vias: 75.84,41.27
N$136  (via drill 0.9 pad 1.68)
  other vias: 75.84,43.81
N$137  (via drill 0.9 pad 1.68)
  other vias: 75.84,46.35
N$138  (via drill 0.9 pad 1.68)
  other vias: 75.84,48.89
N$139  (via drill 0.9 pad 1.68)
  other vias: 75.84,51.43
N$140  (via drill 0.9 pad 1.68)
  other vias: 75.84,53.97
N$141  (via drill 0.9 pad 1.68)
  other vias: 75.84,56.51
N$142  (via drill 0.9 pad 1.68)
  other vias: 75.84,59.05
N$143  (via drill 0.9 pad 1.68)
  other vias: 98.51,14.85
N$144  (via drill 0.9 pad 1.68)
  other vias: 98.51,17.39
N$145  (via drill 0.9 pad 1.68)
  other vias: 98.51,19.93
N$146  (via drill 0.9 pad 1.68)
  other vias: 95.97,19.93
N$147  (via drill 0.9 pad 1.68)
  other vias: 95.97,17.39
N$148  (via drill 0.9 pad 1.68)
  other vias: 95.97,14.85
N$149  (via drill 0.9 pad 1.68)
  other vias: 70.76,59.05
N$150  (via drill 0.9 pad 1.68)
  other vias: 73.3,59.05
N$151  (via drill 0.9 pad 1.68)
  other vias: 73.3,56.51
N$152  (via drill 0.9 pad 1.68)
  other vias: 70.76,56.51
N$153  (via drill 0.9 pad 1.68)
  other vias: 70.76,53.97
N$154  (via drill 0.9 pad 1.68)
  other vias: 73.3,53.97
N$155  (via drill 0.9 pad 1.68)
  other vias: 73.3,51.43
N$156  (via drill 0.9 pad 1.68)
  other vias: 70.76,51.43
N$157  (via drill 0.9 pad 1.68)
  other vias: 70.76,48.89
N$158  (via drill 0.9 pad 1.68)
  other vias: 73.3,48.89
N$159  (via drill 0.9 pad 1.68)
  other vias: 73.3,46.35
N$160  (via drill 0.9 pad 1.68)
  other vias: 70.76,46.35
N$161  (via drill 0.9 pad 1.68)
  other vias: 70.76,43.81
N$162  (via drill 0.9 pad 1.68)
  other vias: 73.3,43.81
N$163  (via drill 0.9 pad 1.68)
  other vias: 73.3,41.27
N$165  (via drill 0.9 pad 1.68)
  other vias: 70.76,41.27
N$171  (via drill 0.9 pad 1.68)
  other vias: 68.22,41.27
N$172  (via drill 0.9 pad 1.68)
  other vias: 68.22,43.81
N$173  (via drill 0.9 pad 1.68)
  other vias: 68.22,46.35
N$174  (via drill 0.9 pad 1.68)
  other vias: 68.22,48.89
N$175  (via drill 0.9 pad 1.68)
  other vias: 68.22,51.43
N$176  (via drill 0.9 pad 1.68)
  other vias: 68.22,53.97
N$177  (via drill 0.9 pad 1.68)
  other vias: 68.22,56.51
N$178  (via drill 0.9 pad 1.68)
  other vias: 68.22,59.05
N$179  (via drill 0.9 pad 1.68)
  other vias: 93.43,14.85
N$180  (via drill 0.9 pad 1.68)
  other vias: 93.43,17.39
N$181  (via drill 0.9 pad 1.68)
  other vias: 93.43,19.93
N$182  (via drill 0.9 pad 1.68)
  other vias: 90.89,19.93
N$183  (via drill 0.9 pad 1.68)
  other vias: 90.89,17.39
N$184  (via drill 0.9 pad 1.68)
  other vias: 90.89,14.85
N$185  (via drill 0.9 pad 1.68)
  other vias: 65.68,59.05
N$186  (via drill 0.9 pad 1.68)
  other vias: 65.68,56.51
N$187  (via drill 0.9 pad 1.68)
  other vias: 65.68,53.97
N$188  (via drill 0.9 pad 1.68)
  other vias: 65.68,51.43
N$189  (via drill 0.9 pad 1.68)
  other vias: 65.68,48.89
N$190
  Bottom 0.305: 334°.VCC 80.79,150.52 C19.1 80.89,147.95 R49.1
N$191
  Bottom 0.305: 347°.VCC 92.32,147.24 C21.1 92.32,142.72 R51.1
N$192  (via drill 0.9 pad 1.68)
  other vias: 65.68,46.35
N$193  (via drill 0.9 pad 1.68)
  other vias: 65.68,43.81
N$194  (via drill 0.9 pad 1.68)
  other vias: 65.68,41.27
N$197  (via drill 0.9 pad 1.68)
  other vias: 88.35,14.85
N$198  (via drill 0.9 pad 1.68)
  other vias: 88.35,17.39
N$199  (via drill 0.9 pad 1.68)
  other vias: 88.35,19.93
N$201
  Bottom 0.305: 334°.OUT 88.77,153.6 R50.1
N$202
  Bottom 0.305: R52.1 100.25,151.21 arc90 347°.OUT
N$203  (via drill 0.9 pad 1.68)
  other vias: 85.81,19.93
N$204  (via drill 0.9 pad 1.68)
  other vias: 85.81,17.39
N$205  (via drill 0.9 pad 1.68)
  other vias: 85.81,14.85
N$207  (via drill 0.9 pad 1.68)
  other vias: 60.6,59.05
N$208  (via drill 0.9 pad 1.68)
  other vias: 63.14,59.05
N$209  (via drill 0.9 pad 1.68)
  other vias: 63.14,56.51
N$210  (via drill 0.9 pad 1.68)
  other vias: 60.6,56.51
N$211  (via drill 0.9 pad 1.68)
  other vias: 60.6,53.97
N$214  (via drill 0.9 pad 1.68)
  other vias: 63.14,53.97
N$215  (via drill 0.6)
  Top 0.305: v196.3,58.64 166.23,28.57 109.66,28.57 R4.1 | v202.65,101.82 196.14,101.82 DX.TX
  Bottom 0.305: v196.3,58.64 196.3,66.89 201.38,71.97 204.56,71.97 205.19,72.61 205.19,99.28 v202.65,101.82
N$216  (via drill 0.9 pad 1.68)
  other vias: 63.14,51.43
N$217  (via drill 0.9 pad 1.68)
  other vias: 60.6,51.43
N$218  (via drill 0.9 pad 1.68)
  other vias: 60.6,48.89
N$219  (via drill 0.9 pad 1.68)
  other vias: 63.14,48.89
N$220  (via drill 0.9 pad 1.68)
  other vias: 63.14,46.35
N$221  (via drill 0.9 pad 1.68)
  other vias: 60.6,46.35
N$222  (via drill 0.9 pad 1.68)
  other vias: 60.6,43.81
N$223  (via drill 0.9 pad 1.68)
  other vias: 63.14,43.81
N$224  (via drill 0.9 pad 1.68)
  other vias: 63.14,41.27
N$226  (via drill 0.9 pad 1.68)
  other vias: 60.6,41.27
N$235  (via drill 0.9 pad 1.68)
  other vias: 58.06,41.27
N$236  (via drill 0.9 pad 1.68)
  other vias: 58.06,43.81
N$237  (via drill 0.9 pad 1.68)
  other vias: 58.06,46.35
N$238  (via drill 0.9 pad 1.68)
  other vias: 58.06,48.89
N$241  (via drill 0.9 pad 1.68)
  other vias: 58.06,51.43
N$242  (via drill 0.9 pad 1.68)
  other vias: 58.06,53.97
N$243  (via drill 0.9 pad 1.68)
  other vias: 58.06,56.51
N$244  (via drill 0.9 pad 1.68)
  other vias: 58.06,59.05
N$245  (via drill 0.9 pad 1.68)
  other vias: 83.27,14.85
N$246  (via drill 0.9 pad 1.68)
  other vias: 83.27,17.39
N$247  (via drill 0.9 pad 1.68)
  other vias: 83.27,19.93
N$248  (via drill 0.9 pad 1.68)
  other vias: 80.73,19.93
N$249  (via drill 0.9 pad 1.68)
  other vias: 80.73,17.39
N$250  (via drill 0.9 pad 1.68)
  other vias: 80.73,14.85
N$251  (via drill 0.9 pad 1.68)
  other vias: 55.52,59.05
N$252  (via drill 0.9 pad 1.68)
  other vias: 55.52,56.51
N$253  (via drill 0.9 pad 1.68)
  other vias: 55.52,53.97
N$254  (via drill 0.9 pad 1.68)
  other vias: 55.52,51.43
N$255  (via drill 0.9 pad 1.68)
  other vias: 55.52,48.89
N$256  (via drill 0.9 pad 1.68)
  other vias: 55.52,46.35
N$257  (via drill 0.9 pad 1.68)
  other vias: 55.52,43.81
N$258  (via drill 0.9 pad 1.68)
  other vias: 55.52,41.27
N$263  (via drill 0.9 pad 1.68)
  other vias: 52.98,41.27
N$264  (via drill 0.9 pad 1.68)
  other vias: 52.98,43.81
N$265  (via drill 0.9 pad 1.68)
  other vias: 52.98,46.35
N$266  (via drill 0.9 pad 1.68)
  other vias: 52.98,48.89
N$267  (via drill 0.9 pad 1.68)
  other vias: 52.98,51.43
N$268  (via drill 0.9 pad 1.68)
  other vias: 52.98,53.97
N$269  (via drill 0.9 pad 1.68)
  other vias: 52.98,56.51
N$270  (via drill 0.9 pad 1.68)
  other vias: 52.98,59.05
N$271  (via drill 0.9 pad 1.68)
  other vias: 78.19,14.85
N$272  (via drill 0.9 pad 1.68)
  other vias: 78.19,17.39
N$273  (via drill 0.9 pad 1.68)
  other vias: 78.19,19.93
N$315  (via drill 0.9 pad 1.68)
  other vias: 75.65,19.93
N$316  (via drill 0.9 pad 1.68)
  other vias: 75.65,17.39
N$317  (via drill 0.9 pad 1.68)
  other vias: 75.65,14.85
N$318  (via drill 0.9 pad 1.68)
  other vias: 50.44,59.05
N$319  (via drill 0.9 pad 1.68)
  other vias: 50.44,56.51
N$320  (via drill 0.9 pad 1.68)
  other vias: 50.44,53.97
N$321  (via drill 0.9 pad 1.68)
  other vias: 50.44,51.43
N$322  (via drill 0.9 pad 1.68)
  other vias: 50.44,48.89
N$323  (via drill 0.9 pad 1.68)
  other vias: 50.44,46.35
N$324  (via drill 0.9 pad 1.68)
  other vias: 50.44,43.81
N$325  (via drill 0.9 pad 1.68)
  other vias: 50.44,41.27
N$330  (via drill 0.9 pad 1.68)
  other vias: 47.9,41.27
N$331  (via drill 0.9 pad 1.68)
  other vias: 47.9,43.81
N$332  (via drill 0.9 pad 1.68)
  other vias: 47.9,46.35
N$333  (via drill 0.9 pad 1.68)
  other vias: 47.9,48.89
N$334  (via drill 0.9 pad 1.68)
  other vias: 47.9,51.43
N$335  (via drill 0.9 pad 1.68)
  other vias: 47.9,53.97
N$336  (via drill 0.9 pad 1.68)
  other vias: 47.9,56.51
N$337  (via drill 0.9 pad 1.68)
  other vias: 47.9,59.05
N$338  (via drill 0.9 pad 1.68)
  other vias: 73.11,14.85
N$339  (via drill 0.9 pad 1.68)
  other vias: 73.11,17.39
N$340  (via drill 0.9 pad 1.68)
  other vias: 73.11,19.93
N$341  (via drill 0.9 pad 1.68)
  other vias: 70.57,19.93
N$342  (via drill 0.9 pad 1.68)
  other vias: 70.57,17.39
N$343  (via drill 0.9 pad 1.68)
  other vias: 70.57,14.85
NC
  Top 0.305: TEENSY3.2_1.8 TEENSY3.2_1.7
PROGRAM  (via drill 0.6)
  Top 0.305: v107.4,35.78 109.94,35.78 114.39,40.22 114.39,41.49 113.75,42.13 106.59,42.13 v105.95,42.76
  Bottom 0.305: TEENSY3.2_1.PGM 104.77,84.08 105.95,82.89 v105.95,42.76 | USB_2.5 89.62,34.51 90.26,35.14 106.77,35.14 v107.4,35.78
PWM1-2
  Top 0.305: QUANTUM_CONNECTOR.4 92.27,127.74 91.53,128.49 81.37,128.49 76.92,124.04 76.92,118.3 ASX.PWM
PWM2-2
  Top 0.305: ADX.PWM 136.47,129.52 132.04,133.95 113.5,133.95 109.94,130.39 102.96,130.39 99.78,127.22 99.78,126.16 QUANTUM_CONNECTOR.10
PWM3-2
  Bottom 0.305: PDX.PWM 136.43,98.01 111.85,98.01 109.31,100.55 108.04,100.55 93.43,115.15 93.43,117.06 QUANTUM_CONNECTOR.9
PWM4-2  (via drill 0.6)
  Top 0.305: QUANTUM_CONNECTOR.3 92.27,122.24 90.26,120.23 80.1,120.23 79.46,119.6 79.46,112.61 82.64,109.44 82.64,108.17 v83.91,106.9
  Bottom 0.305: PSX.PWM 76.2,85.22 78.19,87.21 78.19,95.47 78.83,96.1 78.83,101.82 v83.91,106.9
RED(RGB)  (via drill 0.6)
  Top 0.305: R-R.1 v140.03,143.97 | v128.74,131.66 125.82,131.66 125.18,132.3 116.29,132.3 111.34,127.34 111.34,122.26 106.77,117.69 87.72,117.69 v87.08,117.06 | v111.21,68.16 110.58,68.8 110.58,73.24 109.31,74.51 107.4,74.51 TEENSY3.2_1.25
  Bottom 0.305: v128.74,131.66 128.99,131.66 138.52,141.19 138.52,142.46 v140.03,143.97 | v87.08,117.06 87.08,116.42 105.5,98.01 106.77,98.01 119.47,85.31 119.47,70.07 117.56,68.16 v111.21,68.16
S1-A0  (via drill 0.6)
  Top 0.305: TEENSY3.2_1.15/A1 101.05,80.86 101.05,82.77 100.42,83.4 98.51,83.4 98.51,85.94 102.32,89.75 107.4,89.75 108.04,90.39 v108.04,93.56
  Bottom 0.305: R24.2 C27.1 111.58,135.84 109.31,133.57 80.1,133.57 79.46,132.93 79.46,118.96 104.86,93.56 v108.04,93.56
S2-A1  (via drill 0.6)
  Top 0.305: v106.77,94.83 106.77,91.02 106.13,90.39 101.69,90.39 v95.97,84.67
  Bottom 0.305: R26.2 C29.2 122.97,143.42 112.48,132.93 80.73,132.93 80.1,132.3 80.1,119.6 104.86,94.83 v106.77,94.83 | v95.97,84.67 95.97,78.32 97.34,76.95 TEENSY3.2_1.16/A2
S3-A2  (via drill 0.6)
  Top 0.305: v105.5,96.1 105.5,91.66 104.86,91.02 100.42,91.02 v99.78,90.39
  Bottom 0.305: R28.2 C31.2 135.59,143.97 132.8,141.19 122.01,141.19 113.12,132.3 81.37,132.3 80.73,131.66 80.73,120.23 104.86,96.1 v105.5,96.1 | TEENSY3.2_1.17/A3 101.05,75.78 101.05,89.75 100.42,90.39 v99.78,90.39
S4-A3  (via drill 0.6)
  Top 0.305: TEENSY3.2_1.18/A4 102.35,71.87 103.59,73.11 v108.8,73.11 | v117.56,73.24 v122.01,73.24
  Bottom 0.305: R30.2 C33.2 155.96,128.49 137.88,110.41 137.88,76.29 134.83,73.24 v122.01,73.24 | v108.8,73.11 109.18,73.24 v117.56,73.24
S5-A4  (via drill 0.6)
  Top 0.305: v104.86,61.81 v108.67,61.81
  Bottom 0.305: R32.2 C35.2 178.02,149.44 138.52,109.94 138.52,68.16 134.71,64.35 125.18,64.35 124.55,64.99 117.56,64.99 115.66,63.08 110.58,63.08 109.31,61.81 v108.67,61.81 | TEENSY3.2_1.19/A5 99.69,68.89 100.32,68.89 101.05,68.16 101.05,66.26 101.69,65.62 102.96,65.62 103.59,64.99 103.59,63.72 104.86,62.45 v104.86,61.81
S6-A5  (via drill 0.6)
  Top 0.305: v133.94,65.49 v137.88,65.49 | TEENSY3.2_1.20/A6 100.86,65.62 102.96,65.62 104.86,63.72 110.58,63.72 111.08,64.22 v111.08,65.49
  Bottom 0.305: R34.2 C37.2 171.12,141.4 139.15,109.44 139.15,66.76 v137.88,65.49 | v133.94,65.49 v111.08,65.49
S7-A6  (via drill 0.6)
  Top 0.305: v104.35,59.27 v108.67,59.27
  Bottom 0.305: R36.2 C42.2 174.95,122.63 172.93,120.61 151.6,120.61 139.79,108.8 139.79,65.62 136.61,62.45 118.07,62.45 116.16,60.54 113.75,60.54 112.48,59.27 v108.67,59.27 | TEENSY3.2_1.21/A7 100.86,63.08 102.96,63.08 103.46,62.57 103.46,60.16 v104.35,59.27
S8-A7  (via drill 0.6)
  Top 0.305: v97.37,56.55 v97.37,58.76 | v103.46,57.87 v110.58,57.87
  Bottom 0.305: v103.46,57.87 100.92,55.33 97.98,55.33 97.37,55.94 v97.37,56.55 | v97.37,58.76 97.37,59.4 TEENSY3.2_1.22/A8 | v110.58,57.87 115.66,57.87 119.59,61.81 137.25,61.81 140.42,64.99 140.42,93.56 141.06,94.2 146.77,94.2 147.41,94.83 147.41,97.37 148.68,98.64 162.01,98.64 163.54,97.12 163.54,93.94 173.06,93.94 174.58,95.47 190.59,95.47 195.7,100.58 C44.2 198.38,104.85 R38.2
S9-A8  (via drill 0.6)
  Top 0.305: IC2.9 73.93,63.08 74.69,62.32 95.72,62.32 98.77,59.27 99.59,59.27 TEENSY3.2_1.23/A9 99.69,58.73 105.5,52.92 v108.67,52.92
  Bottom 0.305: R40.2 C46.2 123.32,59.95 116.29,52.92 v108.67,52.92
S10-A9  (via drill 0.6)
  Top 0.305: IC2.8 72.66,62.45 73.42,61.68 92.42,61.68 94.07,60.03 94.07,47.84 97.88,44.03 v97.88,33.24 | v144.87,30.06 144.23,29.43 111.85,29.43 110.58,30.7 104.23,30.7 v101.69,33.24
  Bottom 0.305: R42.2 C48.2 148.13,30.06 v144.87,30.06 | v97.88,33.24 v101.69,33.24
S11-A10  (via drill 0.6)
  Top 0.305: IC2.7 71.39,61.81 72.15,61.05 91.91,61.05 93.43,59.53 93.43,47.21 96.61,44.03 v96.61,25.62
  Bottom 0.305: R44.2 103.32,18.95 C50.2 100.43,19.28 99.78,18.63 97.88,18.63 97.24,19.27 97.24,24.98 v96.61,25.62
S12-A11  (via drill 0.6)
  Top 0.305: IC2.6 70.12,61.18 70.88,60.41 91.4,60.41 92.8,59.02 92.8,46.57 95.34,44.03 v95.34,37.68
  Bottom 0.305: R46.2 C52.2 64,37.05 94.7,37.05 v95.34,37.68
S13-A12  (via drill 0.6)
  Top 0.305: IC2.5 68.85,63.27 v68.67,63.08
  Bottom 0.305: R14.2 C2.2 32.79,69.11 35.65,66.26 43.9,66.26 45.81,64.35 67.4,64.35 v68.67,63.08
S14-A13
  Bottom 0.305: R16.2 C8.2 24.25,111.5 25.13,112.38 30.16,112.38 33.74,108.8 33.74,75.78 36.28,73.24 40.73,73.24 48.98,64.99 88.99,64.99 96.3,57.82 100.26,57.82 100.92,58.48 100.92,60.41 TEENSY3.2_1.A10
S15-A14
  Bottom 0.305: R18.2 C10.2 27.86,125.95 29.93,125.95 34.38,121.5 34.38,76.42 36.92,73.88 41.36,73.88 49.62,65.62 100.86,65.62 TEENSY3.2_1.A11
S16-A15  (via drill 0.6)
  Top 0.305: TEENSY3.2_1.A12 105.94,68.16 v97.5,68.16
  Bottom 0.305: R20.2 C12.2 30.37,147.73 35.01,143.09 35.01,77.05 37.55,74.51 42,74.51 50.25,66.26 95.59,66.26 v97.5,68.16
S17-A16
  Bottom 0.305: R22.2 C16.2 42.63,164.37 42.63,162.78 41.9,162.04 41.9,149.34 35.65,143.09 35.65,77.69 38.19,75.15 42.63,75.15 50.89,66.89 94.07,66.89 97.88,70.7 102.32,70.7 103.59,69.43 103.59,67.53 104.32,66.79 TEENSY3.2_1.A13
S18-A17
  Bottom 0.305: R48.2 69.72,152.16 C18.2 69.72,151.57 77.56,143.73 77.56,117.06 108.67,85.94 108.67,77.69 108.04,77.05 107.4,77.05 TEENSY3.2_1.26
S19-A18  (via drill 0.6)
  Top 0.305: v109.94,79.59 107.4,79.59 TEENSY3.2_1.27
  Bottom 0.305: R50.2 88.87,144.94 C20.1 88.87,143.61 86.45,141.19 79.46,141.19 78.19,139.28 78.19,117.69 109.31,86.58 110.58,86.58 111.21,85.94 111.21,80.23 110.58,79.59 v109.94,79.59 | 107.4,79.59 TEENSY3.2_1.27
S20-A19  (via drill 0.6)
  Top 0.305: v92.16,140.55 v99.78,140.55 | v109.31,92.29 109.31,90.39 108.04,89.12 106.77,89.12 105.98,88.33 105.98,83.36 TEENSY3.2_1.28
  Bottom 0.305: R52.2 97.45,145.52 C22.2 100.25,141.02 v99.78,140.55 | v92.16,140.55 80.1,140.55 78.83,138.65 78.83,118.33 104.86,92.29 v109.31,92.29
SCK_13  (via drill 0.6)
  Top 0.305: v42,69.43 50.25,77.69 60.41,77.69 v61.05,77.05
  Bottom 0.305: D13.3 20.53,85.18 36.28,69.43 v42,69.43 | v61.05,77.05 62.95,77.05 63.59,77.69 71.84,77.69 72.48,77.05 78.19,77.05 81.37,80.23 81.37,92.29 82,92.93 82,97.37 85.81,101.18 90.89,101.18 98.51,93.56 98.51,85.75 TEENSY3.2_1.13
SCL_29  (via drill 0.6)
  Top 0.305: v45.17,66.89 45.17,70.07 51.52,76.42 57.24,76.42 58.51,75.15 v58.51,74.51 | v102.32,77.24 101.05,75.78 v97.88,75.78
  Bottom 0.305: D6.3 25.61,77.56 36.28,66.89 v45.17,66.89 | v58.51,74.51 62.95,74.51 64.86,76.42 70.57,76.42 71.21,75.78 77.56,75.78 79.46,73.88 95.97,73.88 v97.88,75.78 | TEENSY3.2_1.29 104.67,82.13 104.23,82.13 102.32,80.23 v102.32,77.24
SDA_30  (via drill 0.6)
  Top 0.305: v43.9,68.16 43.9,70.07 50.89,77.05 58.51,77.05 v59.78,75.78 | v97.88,78.96 98.51,78.32 103.59,78.32 TEENSY3.2_1.30
  Bottom 0.305: D30.3 23.07,81.37 36.28,68.16 v43.9,68.16 | v59.78,75.78 62.95,75.78 64.22,77.05 71.21,77.05 71.84,76.42 78.83,76.42 82,79.59 82,91.66 82.64,92.29 82.64,96.74 86.45,100.55 90.26,100.55 97.88,92.93 v97.88,78.96
SOLENOIDE  (via drill 0.6)
  Top 0.305: JP4.1 80.17,109.37 78.83,110.71 78.83,120.87 81.37,123.41 v86.45,123.41
  Bottom 0.305: JP4.2 JP4.1 | QUANTUM_CONNECTOR.14 103.72,124.8 88.48,124.8 87.08,123.41 v86.45,123.41
TEENSY1-RX_TEENSY2-TX  (via drill 0.6)
  Top 0.305: QUANTUM_CONNECTOR.29 130.28,123.51 135.6,118.2 137.37,118.2 142.96,112.61 142.96,102.58 v144.23,101.31 | TEENSY3.2_1.0 115.66,54.83 142.96,54.83 144.23,56.1 v144.23,61.81 | v144.23,97.12 v144.23,75.78
  Bottom 0.305: v144.23,101.31 v144.23,97.12 | v144.23,75.78 v144.23,61.81
TEENSY1-TX_TEENSY2-RX  (via drill 0.6)
  Top 0.305: QUANTUM_CONNECTOR.30 129.9,126.05 135.34,120.61 137.37,120.61 145.76,112.23 v145.76,104.61 | v145.76,65.11 145.76,64.35 144.49,63.08 135.98,63.08 v135.47,63.46 | v145.76,95.34 v145.76,78.32 | v119.47,63.72 119.47,57.37 118.73,56.63 TEENSY3.2_1.1
  Bottom 0.305: 145.76,78.58 v145.76,78.32 v145.76,65.11 | v145.76,104.61 v145.76,95.34 | v135.47,63.46 135.09,63.08 120.1,63.08 v119.47,63.72
TX1-RX2  (via drill 0.6)
  Top 0.305: PX.TX 107.17,21.81 95.34,21.81 94.07,23.08 94.07,34.51 92.16,36.41 92.16,42.76 90.89,44.03 90.89,51.65 89.77,52.74 89.75,52.77 65.01,52.77 64.48,53.3 64.48,60.41 62.95,61.94 62.95,64.99 44.54,64.99 39.46,70.07 v39.46,71.97
  Bottom 0.305: SX.RX 26.72,108.17 30.57,108.17 33.11,105.63 33.11,75.15 36.28,71.97 v39.46,71.97
TX2-RX3  (via drill 0.6)
  Top 0.305: SX.TX 26.53,106.26 v37.55,106.26
  Bottom 0.305: v37.55,106.26 36.92,106.9 36.92,141.82 40.73,145.63 56.6,145.63 57.87,144.36 57.87,141.82 58.51,141.19 66.13,141.19 66.95,142.01 AX.RX
TX3-RX4  (via drill 0.6)
  Top 0.305: DX.RX v171.13,106.04 | v68.21,138.65 66.76,138.65 64.22,141.19 64.22,142.68 AX.TX | v71.21,138.65 81.37,138.65 82,138.01 106.77,138.01 107.4,138.65 135.98,138.65 140.42,134.2 140.42,132.93 v154.39,118.96
  Bottom 0.305: v71.21,138.65 v68.21,138.65 | v171.13,106.04 167.32,106.04 v154.39,118.96
US-AX  (via drill 0.6)
  Top 0.305: IC2.4 67.4,65.45 v67.4,68.16 | v62.32,148.81 66.76,148.81 69.3,146.27 69.3,143.05 AX.AN
  Bottom 0.305: v67.4,68.16 66.76,67.53 51.52,67.53 43.27,75.78 38.82,75.78 36.28,78.32 36.28,142.46 42.63,148.81 v62.32,148.81
US-DX  (via drill 0.6)
  Top 0.305: IC2.3 66.31,61.63 67.4,60.54 68.67,60.54 69.56,59.65 69.56,57.87 69.68,57.75 90.51,57.75 92.16,56.1 92.16,45.94 94.07,44.03 v94.07,42.76 | v182.33,66.26 178.52,62.45 165.82,62.45 165.19,62.45 150.58,47.84 102.32,47.84 101.69,47.21 v101.69,44.03 | v194.4,97.37 194.4,98.48 DX.AN
  Bottom 0.305: v182.33,66.26 182.33,80.86 174.71,88.48 174.71,92.29 177.25,94.83 191.86,94.83 v194.4,97.37 | v94.07,42.76 100.42,42.76 v101.69,44.03
US-PX  (via drill 0.6)
  Top 0.305: v95.34,28.16 95.34,34.51 92.8,37.05 92.8,43.4 91.53,44.67 91.53,54.95 91.21,55.27 67.33,55.27 67.02,55.46 67.02,59.91 65.04,61.88 IC2.2
  Bottom 0.305: v95.34,28.16 95.97,27.52 98.51,27.52 99.15,26.89 99.15,25.62 102.96,25.62 103.78,24.8 PX.AN
US-SIGNAL  (via drill 0.6)
  Top 0.305: 106.32,28.06 R4.2 106.64,23.49 PX.RX | TEENSY3.2_1.33 104.96,71.87 106.13,70.7 108.04,70.7 108.93,69.81 v108.93,68.16
  Bottom 0.305: v108.93,68.16 108.93,65.88 106.77,63.72 106.77,44.67 110.58,40.86 110.58,36.41 108.67,34.51 97.24,34.51 96.61,33.87 96.61,32.6 97.24,31.97 106.32,31.97 106.64,31.65 106.64,23.81 arc-90 PX.RX
US-SX  (via drill 0.6)
  Top 0.305: SX.AN 29.89,107.53 v39.46,107.53 | v64.86,73.24 65.04,73.43 IC2.23
  Bottom 0.305: v39.46,107.53 39.46,106.26 36.92,103.72 36.92,78.96 39.46,76.42 43.9,76.42 52.16,68.16 64.86,68.16 v64.86,73.24
VBAT  (via drill 0.6)
  Top 0.305: v191.86,68.16 v175.35,68.16 | v164.55,68.8 158.84,68.8 v158.2,68.16 | v151.22,68.16 146.77,72.61 140.64,72.61 R5.2
  Bottom 0.305: BATTERIA.1 193.03,69.34 v191.86,68.16 | v175.35,68.16 174.71,68.8 v164.55,68.8 | v158.2,68.16 v151.22,68.16
  Bottom 2.54: MAIN-SWITCH.2 193.71,75.34 BATTERIA.1
VIN  (via drill 0.6)
  Top 0.305: 99.78,51.46 TEENSY3.2_1.VIN 99.69,50.48 100.42,49.75 147.41,49.75 v148.04,50.38 | D1.A 170.27,73.81 170.27,70.7 153.12,53.56 v151.22,53.56
  Top 2.54: MAIN-SWITCH.1 202.07,80.8 200.75,82.13 184.24,82.13 | 184.24,82.13 183.48,82.13 D2.A | 184.24,82.13 184.24,80.23 179.1,75.09 SWITCH-MOT.2 171.55,75.09 D1.A
  Bottom 0.305: v148.04,50.38 v151.22,53.56
VMOT
  Top 2.54: SWITCH-MOT.1 178.32,80.23 174.08,80.23 170.93,83.37 PDX.VMOT-1 170.72,86.58 165.19,86.58 162.65,88.48 162.65,106.26 168.48,111.2 | ADX.VMOT-1 170.92,113.27 168.48,111.2 | ASX.VMOT-1 48.43,128.4 56.6,120.23 | 56.6,120.23 56.6,101.18 53.76,96.51 | 53.76,96.51 43,96.51 PSX.VMOT-1 52.07,96.65 53.76,96.51 | 56.6,120.23 56.6,147.54 61.05,151.98 77.56,151.98 83.91,145.63 134.05,145.63 168.48,111.2
VUSB  (via drill 0.6)
  Top 0.305: USB_2.1 79.46,35.4 v82.89,38.82
  Bottom 0.305: TEENSY3.2_1.VUSB 102.32,54.19 104.23,54.19 104.86,53.56 104.86,41.49 104.23,40.86 102.96,40.86 101.05,38.95 94.07,38.95 92.8,37.68 83.27,37.68 82.89,38.06 v82.89,38.82

## Text on the board
tPlace: 1 | 3 | 5 | 7 | 9 | 11 | 13 | 15 | 17 | 19 | 21 | 23 | 25 | 27 | 29 | 3.3 | 3.3 | 3.3 | 3.3 | GND | GND | GND | GND | Developed by: / Andrea Valeri / Emanuele Giacomini / Alessio Di Brigida / Fabio Ricci